# EAGLE design piccolo_pcb_v0.9.1 (EAGLE 6.4)
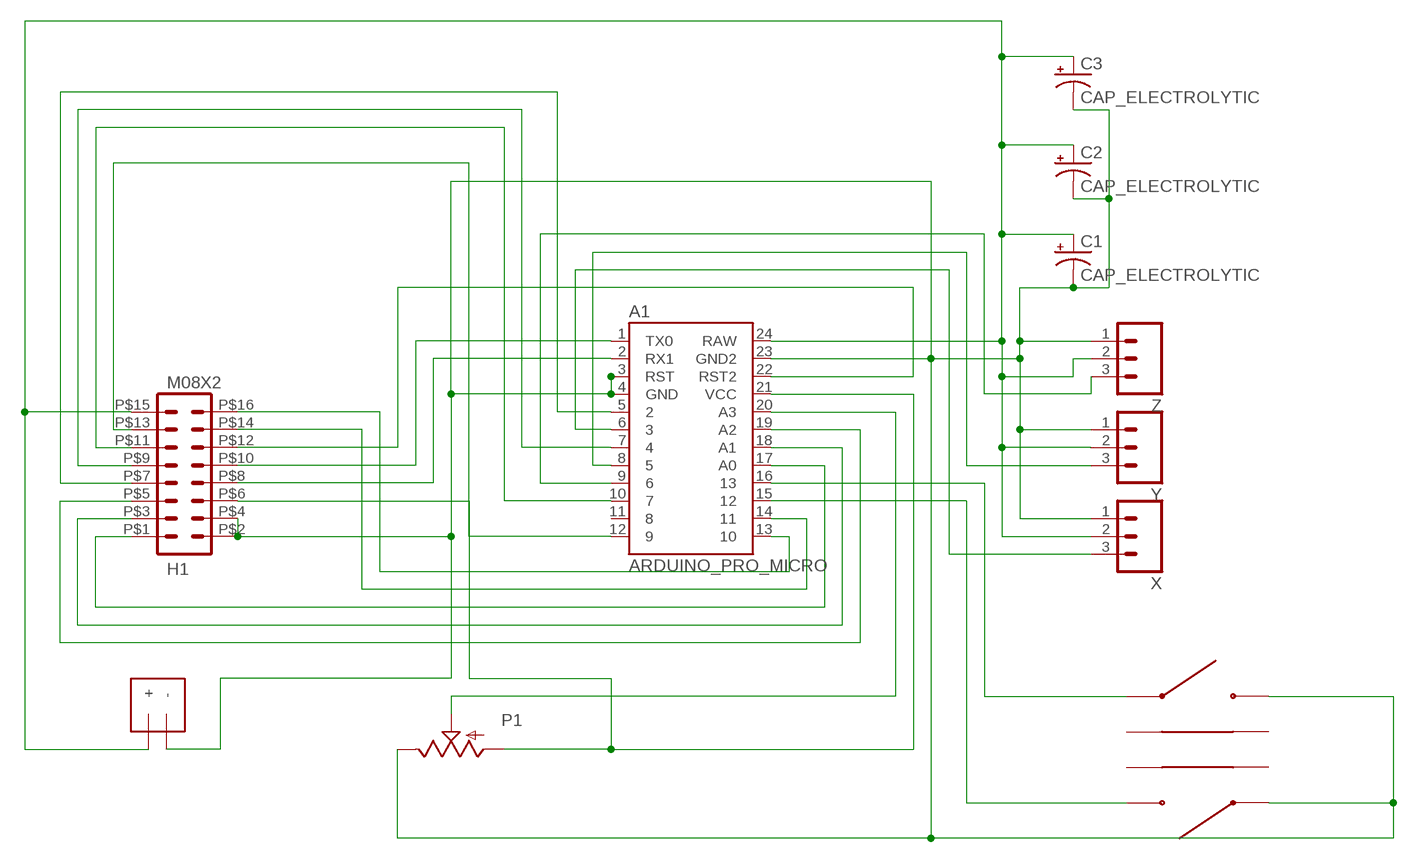
[diagram p0: schematic, sheet 1]

## Parts
A1  ARDUINO_PRO_MICRO  ARDUINO_MINI  [ARDUINO_MINI]
C1  CAP_ELECTROLYTIC  [RADIAL_330UF]
C2  CAP_ELECTROLYTIC  [RADIAL_330UF]
C3  CAP_ELECTROLYTIC  [RADIAL_330UF]
DC_IN  4.8v-6.0v  M02-POL  [JST-PH-2-PTH]
H1  M08X2  [PTH_2X8_90DEG_FEMALE]
P1  POTTHUMBWHEEL  [16MM_THUMBWHEEL]
S1  SWITCH_TACTILE  [RIGHT_ANGLE_TACTSWITCH]
S2  SWITCH_TACTILE  [RIGHT_ANGLE_TACTSWITCH]
X  M03PTH  [1X03]
Y  M03PTH  [1X03]
Z  M03PTH  [1X03]

## Nets
A3: A1.20(A3) P1.P$2(S)
GND: A1.3(RST) A1.4(GND) A1.23(GND2) C1.C(-) C2.C(-) C3.C(-) DC_IN.- H1.P$2 H1.P$4 P1.P$1(E) S1.1 S2.2 X.1 Y.1 Z.1
N$3: A1.15 S1.2
N$4: A1.16 S2.1
PIN2: A1.5 H1.P$7
PIN4: A1.7 H1.P$9
PIN7: A1.10 H1.P$11
PIN9: A1.12 H1.P$13
PIN10: A1.13 H1.P$16
PIN16: A1.14 H1.P$14
PIN_A0: A1.17(A0) H1.P$1
PIN_A1: A1.18(A1) H1.P$3
PIN_A2: A1.19(A2) H1.P$5
PWR_RAW: A1.24(RAW) C1.A(+) C2.A(+) C3.A(+) DC_IN.+ H1.P$15 X.2 Y.2 Z.2
RESET: A1.22(RST2) H1.P$12
RX: A1.2(RX1) H1.P$8
TX: A1.1(TX0) H1.P$10
VCC: A1.21(VCC) H1.P$6 P1.P$3(A)
X_PWM_PIN3: A1.6 X.3
Y_PWM_PIN5: A1.8 Y.3
Z_PWM_PIN6: A1.9 Z.3
Unconnected: A1.11 S1.PE1(GND1) S1.PE2(GND2) S2.PE1(GND1) S2.PE2(GND2)

## Library data of the parts
A1 = SparkFun-Boards:ARDUINO_MINI: Arduino Pro Mini footprint
C1-C3 = Piccolo:CAP_ELECTROLYTIC
DC_IN = Piccolo:M02-POL
H1 = Piccolo:M08X2
P1 = Piccolo:POT
S1 S2 = Piccolo:SWITCH_TACTILE
X Y Z = SparkFun-Connectors:M03: Header 3 Standard 3-pin 0.1" header. Use with straight break away headers (SKU : PRT-00116), right angle break away headers (PRT-00553), swiss pins (PRT-00743), machine pins (PRT-00117), and female headers (PRT-00115). Molex polarized connector foot print use with SKU : PRT-08232 with associated crimp pins and housings.

## Board
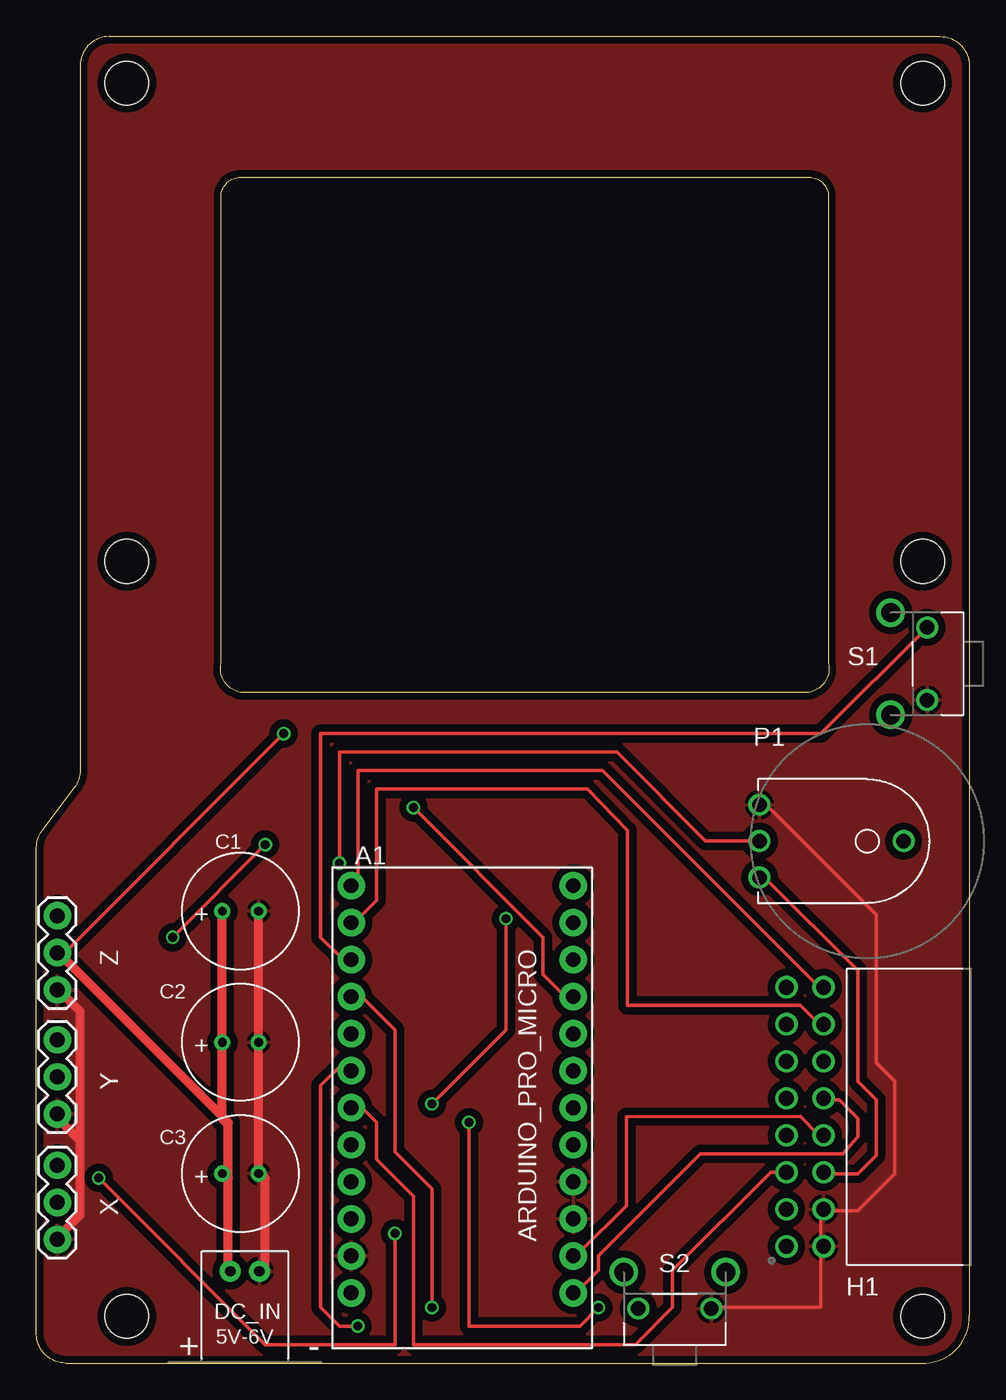
[diagram p1: board, top side]
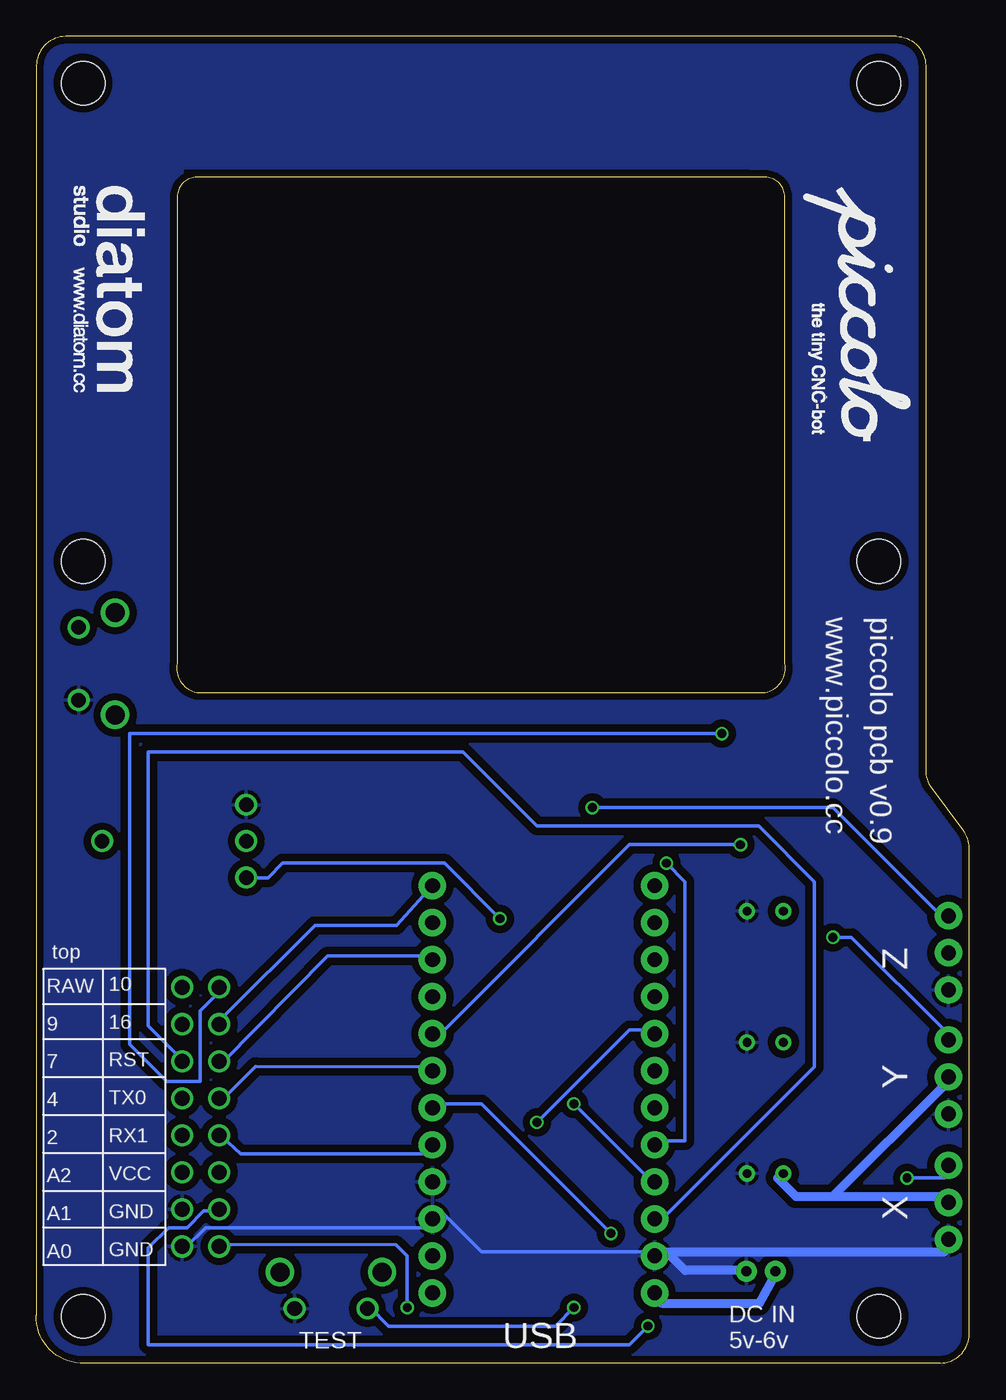
[diagram p2: board, bottom side, seen from below]

Size 64 x 91 mm. Coordinates in mm from the lower left corner, seen from the top.
Outline: 0,2 0,35.33 arc-37 0.4,36.53 2.6,39.47 arc37 3,40.67 3,89 arc-90 5,91 62,91 arc-90 64,89 64,3.27 arc-90 61,0 2,0 arc-90 0,2
Outline: 12.66,48 12.66,80 arc-90 14,81.34 53,81.34 arc-90 54.34,80 54.34,48 arc-90 53,46 14,46 arc-90 12.66,48
Copper layers (1*16): Top 0.035mm / dielectric 1.5mm / Bottom 0.035mm
Design rules "ITEADstudio_DRC": minimum track width 6mil, minimum drill 12mil, track to track 6mil, track to pad 6mil, pad to pad 6mil, via to via 6mil, smd to smd 0mil, copper to edge 10mil, drill to drill 10mil, minimum pad ring 10mil, minimum via ring 6mil, stop-mask expansion 2mil, vias tented up to drill 100mil, thermal gap 10mil
Holes 3 mm at 6.2,87.8 6.2,55 6.2,3.2 60.8,3.2 60.8,55 60.8,87.8

### Footprints (pad centres in the part's own frame; a part is rotated, then mirrored left to right if it is on the bottom)
ARDUINO_MINI = drill 1.016 pad 1.88: 1 -7.62,12.7; 2 -7.62,10.16; 3 -7.62,7.62; 4 -7.62,5.08; 5 -7.62,2.54; 6 -7.62,0; 7 -7.62,-2.54; 8 -7.62,-5.08; 9 -7.62,-7.62; 10 -7.62,-10.16; 11 -7.62,-12.7; 12 -7.62,-15.24; 13 7.62,-15.24; 14 7.62,-12.7; 15 7.62,-10.16; 16 7.62,-7.62; 17 7.62,-5.08; 18 7.62,-2.54; 19 7.62,0; 20 7.62,2.54; 21 7.62,5.08; 22 7.62,7.62; 23 7.62,10.16; 24 7.62,12.7
RADIAL_330UF = drill 0.6: A 0,1.25; C 0,-1.25
JST-PH-2-PTH = drill 0.7 pad 1.448: + -1,0; - 1,0
PTH_2X8_90DEG_FEMALE = drill 1.02: P$1 -2.54,0; P$2 0,0; P$3 -2.54,2.54; P$4 0,2.54; P$5 -2.54,5.08; P$6 0,5.08; P$7 -2.54,7.62; P$8 0,7.62; P$9 -2.54,10.16; P$10 0,10.16; P$11 -2.54,12.7; P$12 0,12.7; P$13 -2.54,15.24; P$14 0,15.24; P$15 -2.54,17.78; P$16 0,17.78
16MM_THUMBWHEEL = drill 1: P$1 -2.5,-7.4; P$2 0,-7.4; P$3 2.5,-7.4; P$4 0,2.5
RIGHT_ANGLE_TACTSWITCH = drill 1: 1 -2.5,0; 2 2.5,0 | drill 1.3: PE1 -3.5,2.5; PE2 3.5,2.5
1X03 = drill 1.016 pad 1.88: 1 0,0; 2 2.54,0; 3 5.08,0

### Placement (x,y rotation side)
A1  29.21,17.51 180 top
C1  14,31 90 top
C2  14,22 90 top
C3  14,13 90 top
DC_IN  14.3,6.3 0 top
H1  54,8 0 top
P1  57,35.8 270 top
S1  61.11,47.97 90 top
S2  43.79,3.74 0 top
X  1.43,8.48 90 top
Y  1.43,17.09 90 top
Z  1.43,25.6 90 top

### Tracks (layer width: path | path; a pad name or v marks a point on that pad's centre or on a via)
A3  (via drill 0.61)
  Top 0.254: v20.78,34.29 20.78,41.91 39.83,41.91 45.91,35.83 49.99,35.83 P1.P$2
  Bottom 0.254: v20.78,34.29 19.51,33.02 19.51,15.24 20.78,15.24 A1.20
GND
  Top 0.254: 53.8,7.89 53.8,3.81 46.18,3.81 S2.2 | 53.8,10.43 56.34,10.43 58.88,12.97 58.88,19.32 57.61,20.59 57.61,30.75 49.99,38.37 P1.P$1 | 53.8,10.43 53.8,7.89 | 53.8,7.89 H1.P$2 | 53.8,10.43 H1.P$4 | 1.73,8.89 X.1
  Top 0.61: DC_IN.- 15.7,6.35 15.7,12.7 C3.C C2.C C1.C | 3,15.24 1.73,16.51 Y.1 | 3,15.24 3,10.16 1.73,8.89 | 3,15.24 3,24.13 1.73,25.4 Z.1
  Bottom 0.254: A1.23 22.05,7.62 33.48,7.62 36.02,10.16 A1.3 37.42,9.27 52.4,9.29 53.8,7.89 H1.P$2
  Bottom 0.61: 20.78,7.62 19.51,6.35 15.7,6.35 DC_IN.- | 20.78,7.62 1.73,7.62 X.1 | 20.78,7.62 A1.23
  pour Bottom (isolate 0.5): 62,91 14,91 14,82 54,82 54,46 13,46 13,91 5,91 arc90 3,89 3,40 0,36 0,2 arc90 2,0 62,0 arc90 64,2 64,89 arc90
  pour Top (isolate 0.5): 62,91 54,91 54,46 13,46 13,91 5,91 arc90 3,89 3,40 0,36 0,2 arc90 2,0 62,0 arc90 64,3.27 64,90.27 arc90
  pour Bottom (isolate 0.5): 12,91 15,91 15,81 12,81
  pour Top (isolate 0.5): 13,91 54,91 54,81 13,81
N$3
  Top 0.254: A1.15 20.78,27.94 19.51,29.21 19.51,43.18 53.82,43.18 S1.2
N$4  (via drill 0.61)
  Top 0.254: v27.13,3.81 27.13,11.94 24.59,14.48 24.59,22.86 22.05,25.4 A1.16
  Bottom 0.254: v27.13,3.81 28.4,2.54 39.83,2.54 41.1,3.81 S2.1
PIN2
  Bottom 0.254: H1.P$7 51.26,15.51 49.99,14.37 37.54,14.35 A1.5
PIN4
  Bottom 0.254: H1.P$9 51.26,18.05 48.97,20.34 37.29,20.32 A1.7
PIN7
  Bottom 0.254: H1.P$11 51.26,20.59 44.02,27.94 37.29,27.94 A1.10
PIN9
  Bottom 0.254: 51.26,23.67 44.89,30.02 39.29,30.02 A1.12
  Bottom 0.61: H1.P$13 arc-90 51.26,23.44 51.26,23.67
PIN10
  Top 0.254: H1.P$16 53.8,25.67 38.83,40.64 22.05,40.64 22.05,33.02 A1.13
PIN16
  Top 0.254: H1.P$14 53.8,23.13 52.4,24.53 40.56,24.53 40.56,36.54 37.8,39.37 23.32,39.37 23.32,31.75 22.05,30.48 A1.14
PIN_A0  (via drill 0.61, 0.61 pad 0.66)
  Top 0.254: v38.56,3.81 37.29,2.54 29.67,2.54 v29.67,16.51
  Bottom 0.254: v38.56,3.81 38.56,7.37 39.32,8.13 51.01,8.14 51.26,7.89 H1.P$1 | v29.67,16.51 23.32,22.86 22.05,22.86 A1.17
PIN_A1  (via drill 0.61)
  Top 0.254: v22.05,2.54 20.78,2.54 19.51,3.81 19.51,19.05 20.78,20.32 A1.18
  Bottom 0.254: v22.05,2.54 23.32,1.27 56.34,1.27 56.34,7.89 54.94,9.29 53.67,9.29 52.53,10.43 51.26,10.43 H1.P$3
PIN_A2
  Top 0.254: H1.P$5 51.26,13.1 50.37,13.08 43.64,6.35 43.64,3.81 41.1,1.27 25.86,1.27 25.86,11.43 23.32,13.97 23.32,16.51 22.05,17.78 A1.19
PWR_RAW  (via drill 0.61)
  Top 0.254: 13.16,6.35 DC_IN.+ | Z.2 1.73,27.94 v16.97,43.18
  Top 0.61: 13.16,6.35 13.16,12.7 | 13.16,16.51 1.73,27.94 | 13.16,12.7 13.16,16.51 | 13.16,12.7 C3.A | 13.16,16.51 arc-90 12.75,16.92 C2.A C1.A
  Bottom 0.25: 52.78,24.15 51.26,25.67 H1.P$15
  Bottom 0.254: 13.16,12.7 C3.A | 13.16,6.35 DC_IN.+ | 1.73,19.05 Y.2 | 52.78,24.15 52.78,19.32 55.07,19.32 57.61,21.86 57.61,43.18 v16.97,43.18
  Bottom 0.61: 9.35,11.43 11.89,11.43 13.16,12.7 | 9.35,11.43 1.73,11.43 X.2 | 13.16,6.35 14.43,4.08 20.86,4.08 arc90 A1.24 | 9.35,11.43 1.73,19.05
RESET
  Bottom 0.254: H1.P$12 53.8,20.59 56.34,23.13 56.34,41.91 34.75,41.91 29.67,36.83 14.43,36.83 10.62,33.02 10.62,20.32 20.78,10.16 A1.22
RX
  Top 0.254: A1.2 37.29,7.62 40.47,10.79 40.47,16.89 52.4,16.91 53.69,15.62 H1.P$8
TX
  Top 0.254: A1.1 37.29,5.08 38.56,6.35 38.56,7.37 45.55,14.35 55.32,14.37 56.34,15.51 56.34,16.78 55.07,18.05 54.11,18.05 H1.P$10
VCC  (via drill 0.61)
  Top 0.254: P1.P$3 49.99,33.29 56.34,26.94 56.34,19.32 57.61,18.05 57.61,14.24 56.34,12.97 53.8,12.97 H1.P$6 | v27.13,17.78 32.21,22.86 v32.21,30.48
  Bottom 0.254: v27.13,17.78 22.05,12.7 A1.21 | v32.21,30.48 36.02,34.29 47.1,34.3 48.11,33.29 49.99,33.29 P1.P$3
X_PWM_PIN3  (via drill 0.61)
  Top 0.254: v4.27,12.7 15.7,1.27 24.59,1.27 v24.59,8.89
  Bottom 0.254: v4.27,12.7 1.73,12.7 X.3 | v24.59,8.89 33.48,17.78 36.02,17.78 A1.6
Y_PWM_PIN5  (via drill 0.61)
  Top 0.254: v15.7,35.56 v9.35,29.21
  Bottom 0.254: v9.35,29.21 8.08,29.21 1.73,22.86 Y.3 | v15.7,35.56 23.32,35.56 36.02,22.86 A1.8
Z_PWM_PIN6  (via drill 0.61)
  Top 0.254: v25.86,38.1 34.75,29.21 34.75,26.67 36.02,25.4 A1.9
  Bottom 0.254: v25.86,38.1 9.35,38.1 1.73,30.48 Z.3

### Text on the board
bPlace: C:/Users/BG/Downloads/diatom_logo_1bit.bmp | piccolo pcb v0.9 | www.piccolo.cc
bNames: Z | top | Y | X | 10 / 16 / RST / TX0 / RX1 / VCC / GND / GND | RAW / 9 / 7 / 4 / 2 / A2 / A1 / A0 | DC IN / 5v-6v | USB | TEST